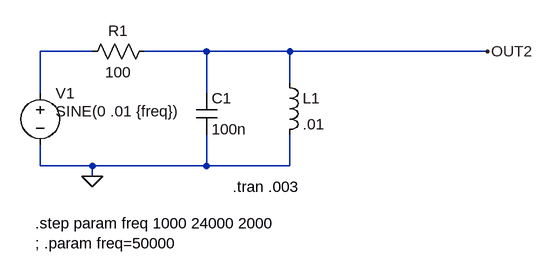
[diagram p0: schematic CircuitBouchon3.asc]
CircuitBouchon3.asc, the LTspice schematic file:
Version 4
SHEET 1 880 680
WIRE 128 80 48 80
WIRE 304 80 208 80
WIRE 432 80 304 80
WIRE 736 80 432 80
WIRE 432 128 432 80
WIRE 48 144 48 80
WIRE 304 144 304 80
WIRE 48 256 48 224
WIRE 128 256 48 256
WIRE 304 256 304 208
WIRE 304 256 128 256
WIRE 432 256 432 208
WIRE 432 256 304 256
WIRE 128 272 128 256
FLAG 128 272 0
FLAG 736 80 OUT2
SYMBOL voltage 48 128 R0
WINDOW 123 24 124 Left 2
WINDOW 39 0 0 Left 0
WINDOW 3 24 44 Left 2
SYMATTR InstName V1
SYMATTR Value SINE(0 .01 {freq})
SYMBOL res 224 64 R90
WINDOW 0 0 56 VBottom 2
WINDOW 3 32 56 VTop 2
SYMATTR InstName R1
SYMATTR Value 100
SYMBOL cap 288 144 R0
SYMATTR InstName C1
SYMATTR Value 100n
SYMBOL ind 416 112 R0
SYMATTR InstName L1
SYMATTR Value .01
TEXT 344 288 Left 2 !.tran .003
TEXT 40 344 Left 2 !.step param freq 1000 24000 2000\n; .param freq=50000

The netlist it stands for:
* CircuitBouchon3.asc
V1 N001 0 SINE(0 .01 {freq})
R1 OUT2 N001 100
C1 OUT2 0 100n
L1 OUT2 0 .01
.tran .003
.step param freq 1000 24000 2000
; .param freq=50000
.backanno
.end